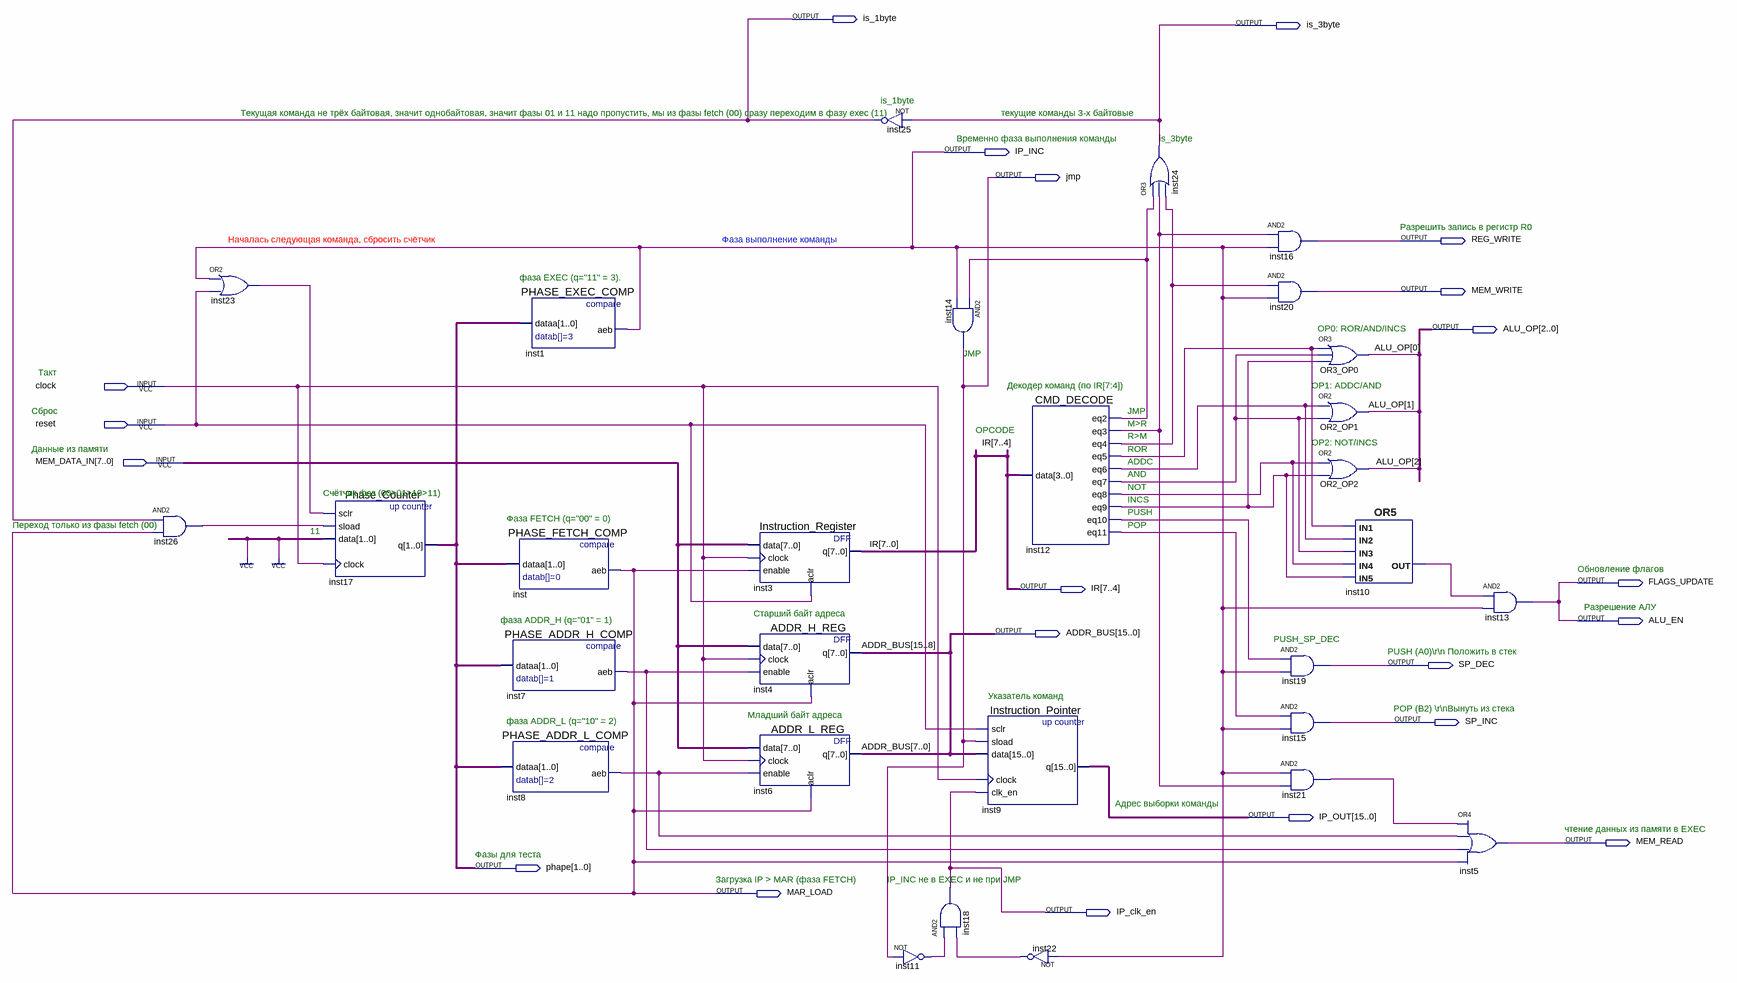
[diagram p0: schematic sheet]
// Quartus schematic control_unit.bdf as structural Verilog: 29 symbols, 21 pins
module control_unit (
  input  clock,
  input  reset,
  input  [7:0] MEM_DATA_IN,
  output is_1byte,
  output is_3byte,
  output IP_INC,
  output jmp,
  output REG_WRITE,
  output MEM_WRITE,
  output [2:0] ALU_OP,
  output FLAGS_UPDATE,
  output [7:0] IR,
  output ALU_EN,
  output [15:0] ADDR_BUS,
  output SP_DEC,
  output SP_INC,
  output [15:0] IP_OUT,
  output MEM_READ,
  output [1:0] phape,
  output MAR_LOAD,
  output IP_clk_en
);

  wire inst7_aeb, inst8_aeb, inst10_out, inst11_out, inst12_eq2, inst12_eq3, inst12_eq4, inst12_eq5,
       inst12_eq6, inst12_eq7, inst12_eq8, inst12_eq9, inst12_eq10, inst12_eq11, inst21_out, inst22_out,
       inst23_out, inst26_out;

  and inst26 (inst26_out, is_1byte, MAR_LOAD);
  or inst23 (inst23_out, IP_INC, reset);
  Phase_Counter inst17 (.sclr(inst23_out), .sload(inst26_out), .data(2'b11), .clock(clock), .q(phape));
  PHASE_FETCH_COMP inst (.dataa(phape), .aeb(MAR_LOAD));
  PHASE_ADDR_H_COMP inst7 (.dataa(phape), .aeb(inst7_aeb));
  PHASE_ADDR_L_COMP inst8 (.dataa(phape), .aeb(inst8_aeb));
  PHASE_EXEC_COMP inst1 (.dataa(phape), .aeb(IP_INC));
  Instruction_Register inst3 (.data(MEM_DATA_IN), .clock(clock), .enable(MAR_LOAD), .aclr(reset), .q(IR));
  ADDR_H_REG inst4 (.data(MEM_DATA_IN), .clock(clock), .enable(inst7_aeb), .aclr(MAR_LOAD), .q(ADDR_BUS[15:8]));
  ADDR_L_REG inst6 (.data(MEM_DATA_IN), .clock(clock), .enable(inst8_aeb), .aclr(MAR_LOAD), .q(ADDR_BUS[7:0]));
  not inst25 (is_1byte, is_3byte);
  not inst11 (inst11_out, jmp);
  and inst14 (jmp, inst12_eq2, IP_INC);
  and inst18 (IP_clk_en, inst11_out, inst22_out);
  Instruction_Pointer inst9 (.sclr(reset), .sload(jmp), .data(ADDR_BUS), .clock(clock), .clk_en(IP_clk_en), .q(IP_OUT));
  CMD_DECODE inst12 (
    .data(IR[7:4]), .eq2(inst12_eq2), .eq3(inst12_eq3), .eq4(inst12_eq4), .eq5(inst12_eq5), .eq6(inst12_eq6),
    .eq7(inst12_eq7), .eq8(inst12_eq8), .eq9(inst12_eq9), .eq10(inst12_eq10), .eq11(inst12_eq11));
  not inst22 (inst22_out, IP_INC);
  or inst24 (is_3byte, inst12_eq2, inst12_eq3, inst12_eq4);
  and inst16 (REG_WRITE, inst12_eq3, IP_INC);
  and inst20 (MEM_WRITE, inst12_eq4, IP_INC);
  or OR3_OP0 (ALU_OP[0], inst12_eq5, inst12_eq7, inst12_eq9);
  or OR2_OP1 (ALU_OP[1], inst12_eq6, inst12_eq7);
  or OR2_OP2 (ALU_OP[2], inst12_eq8, inst12_eq9);
  and inst19 (SP_DEC, inst12_eq10, IP_INC);
  and inst15 (SP_INC, inst12_eq11, IP_INC);
  and inst21 (inst21_out, IP_INC, inst12_eq3);
  or inst10 (inst10_out, inst12_eq5, inst12_eq6, inst12_eq7, inst12_eq8, inst12_eq9);
  or inst5 (MEM_READ, inst21_out, inst8_aeb, inst7_aeb, MAR_LOAD);
  and inst13 (ALU_EN, inst10_out, IP_INC);

  assign FLAGS_UPDATE = ALU_EN;

  // Notes on the sheet:
  //   is_1byte
  //   Текущая команда не трёх байтовая, значит однобайтовая, значит фазы 01 и 11 надо пропустить, мы из фазы fetch (00) сразу переходим в фазу exec (11)
  //   текущие команды 3-х байтовые
  //   Временно фаза выполнения команды
  //   is_3byte
  //   Разрешить запись в регистр R0
  //   Началась следующая команда, сбросить счётчик
  //   Фаза выполнение команды
  //   фаза EXEC (q="11" = 3).
  //   OP0: ROR/AND/INCS
  //   JMP
  //   Такт
  //   Декодер команд (по IR[7:4])
  //   OP1: ADDC/AND
  //   Сброс 
  //   JMP
  //   M>R
  //   OPCODE
  //   R>M
  //   OP2: NOT/INCS
  //   Данные из памяти
  //   ROR
  //   ADDC
  //   AND
  //   NOT
  //   Счётчик фаз (00>01>10>11)
  //   INCS
  //   PUSH
  //   Фаза FETCH (q="00" = 0)
  //   Переход только из фазы fetch (00)
  //   POP
  //   11
  //   Обновление флагов
  //   Разрешение АЛУ
  //   Старший байт адреса
  //   фаза ADDR_H (q="01" = 1)
  //   PUSH_SP_DEC
  //   PUSH (A0)\r\n Положить в стек
  //   Указатель команд
  //   POP (B2) \r\nВынуть из стека
  //   Младший байт адреса
  //   фаза ADDR_L (q="10" = 2)
  //   Адрес выборки команды
  //   чтение данных из памяти в EXEC
  //   Фазы для теста
  //   Загрузка IP > MAR (фаза FETCH)
  //   IP_INC не в EXEC и не при JMP
endmodule
